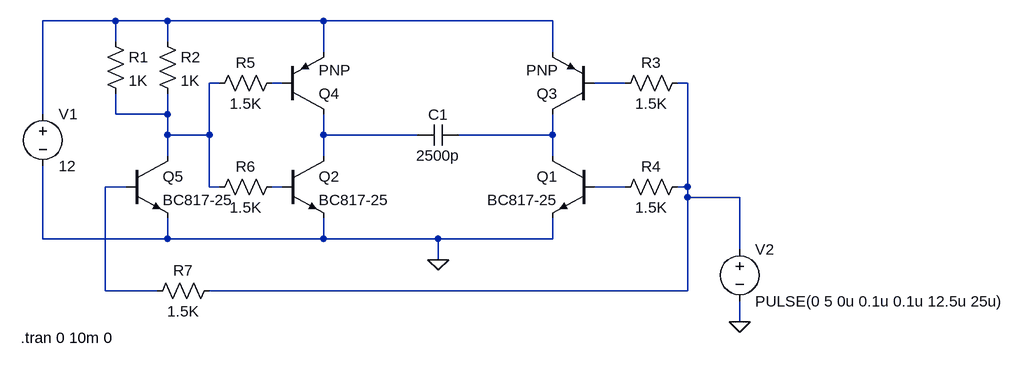
[diagram p0: schematic Ultrasonic Transducer Transmitter Circuit.asc]
Ultrasonic Transducer Transmitter Circuit.asc, the LTspice schematic file:
Version 4
SHEET 1 1212 680
WIRE -160 16 -272 16
WIRE -80 16 -160 16
WIRE 160 16 -80 16
WIRE 512 16 160 16
WIRE -160 48 -160 16
WIRE -80 48 -80 16
WIRE 160 64 160 16
WIRE 512 64 512 16
WIRE 0 112 -16 112
WIRE 96 112 80 112
WIRE 624 112 576 112
WIRE 720 112 704 112
WIRE -272 160 -272 16
WIRE -160 160 -160 128
WIRE -80 160 -80 128
WIRE -80 160 -160 160
WIRE -80 192 -80 160
WIRE -16 192 -16 112
WIRE -16 192 -80 192
WIRE 160 192 160 160
WIRE 304 192 160 192
WIRE 512 192 512 160
WIRE 512 192 368 192
WIRE -80 224 -80 192
WIRE 160 224 160 192
WIRE 512 224 512 192
WIRE -144 272 -176 272
WIRE -16 272 -16 192
WIRE 0 272 -16 272
WIRE 96 272 80 272
WIRE 624 272 576 272
WIRE 720 272 720 112
WIRE 720 272 704 272
WIRE 720 288 720 272
WIRE 800 288 720 288
WIRE -272 352 -272 240
WIRE -80 352 -80 320
WIRE -80 352 -272 352
WIRE 160 352 160 320
WIRE 160 352 -80 352
WIRE 336 352 160 352
WIRE 512 352 512 320
WIRE 512 352 336 352
WIRE 800 368 800 288
WIRE 336 384 336 352
WIRE -176 432 -176 272
WIRE -96 432 -176 432
WIRE 720 432 720 288
WIRE 720 432 -16 432
WIRE 800 480 800 448
FLAG 336 384 0
FLAG 800 480 0
SYMBOL npn 576 224 M0
SYMATTR InstName Q1
SYMATTR Value BC817-25
SYMBOL npn 96 224 R0
SYMATTR InstName Q2
SYMATTR Value BC817-25
SYMBOL pnp 576 160 R180
SYMATTR InstName Q3
SYMBOL pnp 96 160 M180
SYMATTR InstName Q4
SYMBOL res -176 32 R0
SYMATTR InstName R1
SYMATTR Value 1K
SYMBOL res -96 32 R0
SYMATTR InstName R2
SYMATTR Value 1K
SYMBOL res 720 96 R90
WINDOW 0 0 56 VBottom 2
WINDOW 3 32 56 VTop 2
SYMATTR InstName R3
SYMATTR Value 1.5K
SYMBOL res 720 256 R90
WINDOW 0 0 56 VBottom 2
WINDOW 3 32 56 VTop 2
SYMATTR InstName R4
SYMATTR Value 1.5K
SYMBOL npn -144 224 R0
SYMATTR InstName Q5
SYMATTR Value BC817-25
SYMBOL res 96 96 R90
WINDOW 0 0 56 VBottom 2
WINDOW 3 32 56 VTop 2
SYMATTR InstName R5
SYMATTR Value 1.5K
SYMBOL res 96 256 R90
WINDOW 0 0 56 VBottom 2
WINDOW 3 32 56 VTop 2
SYMATTR InstName R6
SYMATTR Value 1.5K
SYMBOL voltage -272 144 R0
WINDOW 123 0 0 Left 2
WINDOW 39 0 0 Left 2
SYMATTR InstName V1
SYMATTR Value 12
SYMBOL voltage 800 352 R0
WINDOW 123 0 0 Left 2
WINDOW 39 0 0 Left 2
SYMATTR InstName V2
SYMATTR Value PULSE(0 5 0u 0.1u 0.1u 12.5u 25u)
SYMBOL cap 368 176 R90
WINDOW 0 0 32 VBottom 2
WINDOW 3 32 32 VTop 2
SYMATTR InstName C1
SYMATTR Value 2500p
SYMBOL res 0 416 R90
WINDOW 0 0 56 VBottom 2
WINDOW 3 32 56 VTop 2
SYMATTR InstName R7
SYMATTR Value 1.5K
TEXT -306 504 Left 2 !.tran 0 10m 0

The netlist it stands for:
* Ultrasonic Transducer Transmitter Circuit.asc
Q1 N007 N010 0 0 BC817-25
Q2 N006 N009 0 0 BC817-25
Q3 N007 N004 N001 0 PNP
Q4 N006 N003 N001 0 PNP
R1 N001 N002 1K
R2 N001 N002 1K
R3 N005 N004 1.5K
R4 N005 N010 1.5K
Q5 N002 N008 0 0 BC817-25
R5 N003 N002 1.5K
R6 N009 N002 1.5K
V1 N001 0 12
V2 N005 0 PULSE(0 5 0u 0.1u 0.1u 12.5u 25u)
C1 N007 N006 2500p
R7 N005 N008 1.5K
.model NPN NPN
.model PNP PNP
.lib standard.bjt
.tran 0 10m 0
.backanno
.end